# Altium schematic sheet Sheet1.SchDoc
size A4
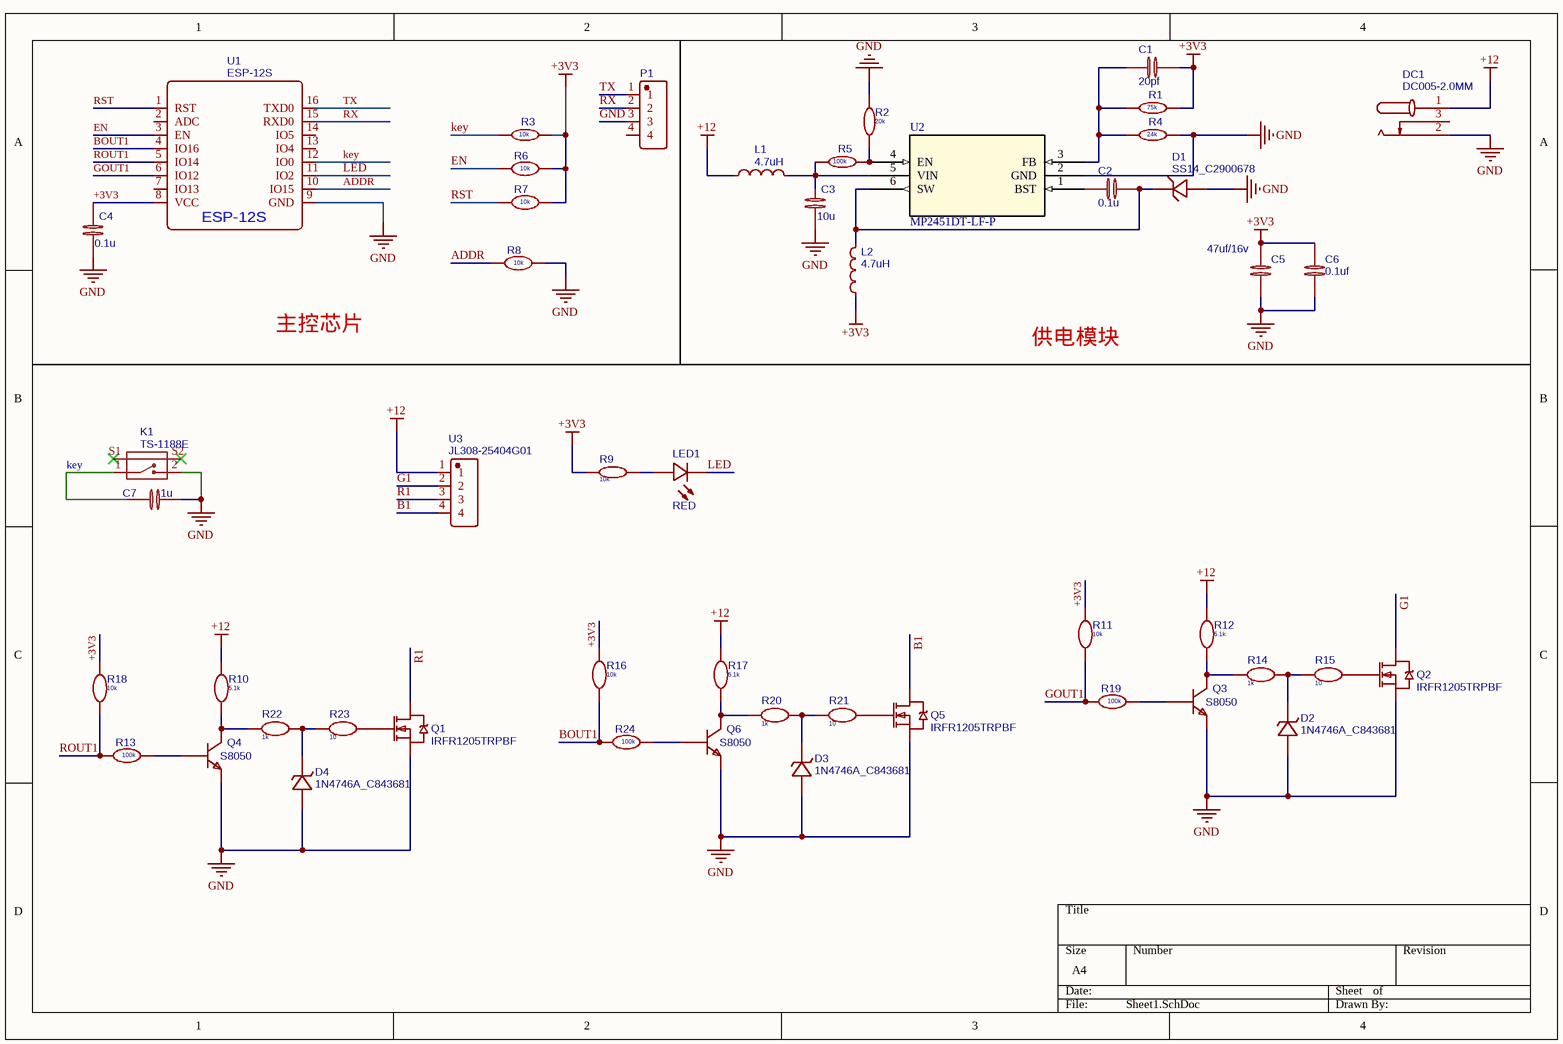
[diagram p0: Sheet1.SchDoc]

## Parts
C1  20pf  [C0603]
C2  0.1u  [C0603]
C3  10u  [C0603]
C4  0.1u  [C0603]
C5  47uf/16v  [C0603]
C6  0.1uf  [C0603]
C7  1u  [C0603]
D1  SS14_C2900678  [SMA_L4.3-W2.5-LS5.0-RD-1]
D2  1N4746A_C843681  [DO-41_BD2.8-L4.2-P8.00-D0.7-FD]
D3  1N4746A_C843681  [DO-41_BD2.8-L4.2-P8.00-D0.7-FD]
D4  1N4746A_C843681  [DO-41_BD2.8-L4.2-P8.00-D0.7-FD]
DC1  DC005-2.0MM  [DC-IN-TH_DC005-T20]
K1  TS-1188E  [SMD SWITCH 7X3.6X2.7]
L1  4.7uH  [IND-SMD_L7.3-W6.6_MHCI06030]
L2  4.7uH  [IND-SMD_L7.3-W6.6_MHCI06030]
LED1  RED  [LED0603-R-RD]
P1  (no value)  [HDR-TH_4P-P2.54-V-M]
Q1  IRFR1205TRPBF  [TO-252-2_L6.5-W6.1-P4.58-LS10.0-TR]
Q2  IRFR1205TRPBF  [TO-252-2_L6.5-W6.1-P4.58-LS10.0-TR]
Q3  S8050  [SOT-23(SOT-23-3)]
Q4  S8050  [SOT-23(SOT-23-3)]
Q5  IRFR1205TRPBF  [TO-252-2_L6.5-W6.1-P4.58-LS10.0-TR]
Q6  S8050  [SOT-23(SOT-23-3)]
R1  75k  [R0603]
R2  20k  [R0603]
R3  10k  [R0603]
R4  24k  [R0603]
R5  100k  [R0603]
R6  10k  [R0603]
R7  10k  [R0603]
R8  10k  [R0603]
R9  10k  [R0603]
R10  5.1k  [R0603]
R11  10k  [R0603]
R12  5.1k  [R0603]
R13  100k  [R0603]
R14  1k  [R0603]
R15  10  [R0603]
R16  10k  [R0603]
R17  5.1k  [R0603]
R18  10k  [R0603]
R19  100k  [R0603]
R20  1k  [R0603]
R21  10  [R0603]
R22  1k  [R0603]
R23  10  [R0603]
R24  100k  [R0603]
U1  ESP-12S  [WIFIM-SMD_ESP-12F-ESP8266MOD]
U2  MP2451DT-LF-P  [SOT23-6_MPS]
U3  JL308-25404G01  [CONN-TH_4P-P2.54_JILN_JL308-25404G01]

## Nets
+3V3: C1.2 C4.2 C5.2 C6.2 L2.1 R1.1 R3.1 R6.2 R7.2 R9.1 R11.2 R16.2 R18.2 U1.8(VCC)
+12: DC1.1 L1.1 R10.2 R12.2 R17.2 U3.1
GND: C3.1 C4.1 C5.1 C6.1 C7.1 D1.2(A) D2.2(A) D3.2(A) D4.2(A) DC1.2 K1.2 P1.3 Q1.3(S) Q2.3(S) Q3.2(E) Q4.2(E) Q5.3(S) Q6.2(E) R2.1 R4.1 R8.2 U1.9(GND) U2.2(GND)
ADDR: R8.1 U1.10(IO15)
B1: Q5.4(D) U3.4
BOUT1: R16.1 R24.1 U1.4(IO16)
EN: R6.1 U1.3(EN)
G1: Q2.4(D) U3.2
GOUT1: R11.1 R19.1 U1.6(IO12)
key: C7.2 K1.1 R3.2 U1.12(IO0)
LED: LED1.2(-) U1.11(IO2)
R1: Q1.4(D) U3.3
ROUT1: R13.1 R18.1 U1.5(IO14)
RST: R7.1 U1.1(RST)
RX: P1.2 U1.15(RXD0)
TX: P1.1 U1.16(TXD0)
NetC1_1: C1.1 R1.2 R4.2 U2.3(FB)
NetC2_1: C2.1 U2.1(BST)
NetC2_2: C2.2 D1.1(C) L2.2 U2.6(SW)
NetC3_2: C3.2 L1.2 R5.2 U2.5(VIN)
NetD2_1: D2.1(K) R14.1 R15.2
NetD3_1: D3.1(K) R20.1 R21.2
NetD4_1: D4.1(K) R22.1 R23.2
NetLED1_1: LED1.1(+) R9.2
NetQ1_1: Q1.1(G) R23.1
NetQ2_1: Q2.1(G) R15.1
NetQ3_1: Q3.1(B) R19.2
NetQ3_3: Q3.3(C) R12.1 R14.2
NetQ4_1: Q4.1(B) R13.2
NetQ4_3: Q4.3(C) R10.1 R22.2
NetQ5_1: Q5.1(G) R21.1
NetQ6_1: Q6.1(B) R24.2
NetQ6_3: Q6.3(C) R17.1 R20.2
NetR2_2: R2.2 R5.1 U2.4(EN)

Not connected (* = marked no-connect by the designer): DC1 3; K1 S1* S2*; P1 4; U1 2(ADC) 7(IO13) 13(IO4) 14(IO5)

## Notes on the sheet
- 主控芯片
- 供电模块

## Library data of the parts
C1-C6 = 0.1u: nameAlias: Value(F); Contributor: LCEDA_Lib; spicePre: C; spiceSymbolName: C_0603_EU
C7 = 1u: nameAlias: Value(F); Contributor: LCEDA_Lib; spicePre: C; spiceSymbolName: C_0603_EU
D1 = SS14_C2900678: BOM_Manufacturer: BLUE ROCKET(蓝箭); BOM_Manufacturer Part: SS14; Contributor: LCSC; BOM_Supplier: LCSC; BOM_Supplier Part: C2900678; spicePre: D; spiceSymbolName: SS14_C2900678
D2-D4 = 1N4746A_C843681: BOM_Manufacturer: FUXINSEMI(富芯森美); Contributor: LCSC; BOM_Supplier: LCSC; BOM_Supplier Part: C843681; BOM_Manufacturer Part: 1N4746A; spicePre: D; spiceSymbolName: 1N4746A_C843681
DC1 = DC005-2.0MM: BOM_Manufacturer: SOFNG; BOM_Supplier: LCSC; BOM_Manufacturer Part: DC005-2.0MM; BOM_Supplier Part: C111567; BOM_JLCPCB Part Class: Extended Part; spicePre: D; spiceSymbolName: DC005-2.0MM
K1 = TS-1188E: BOM_Manufacturer: ReliaPro; BOM_Manufacturer Part: 3*6*3.5 Side press  High temperature; catid: 20; spicePre: K; BOM_Supplier: LCSC; BOM_Supplier Part: C37327
L1 L2 = 4.7uH: BOM_Manufacturer: SXN; BOM_Manufacturer Part: SMMS0630-4R7M; nameAlias: Inductance; BOM_Supplier: LCSC; BOM_Supplier Part: C128688; BOM_JLCPCB Part Class: Extended Part; spicePre: L; spiceSymbolName: SMMS0630-4R7M
LED1 = RED: BOM_Manufacturer: EKINGLUX; BOM_Manufacturer Part: E6C0603URAC1UDA; Contributor: LCSC; BOM_Supplier: LCSC; BOM_Supplier Part: C375444; spicePre: L; spiceSymbolName: E6C0603URAC1UDA
P1 = KH-2.54PH180-1X4P-L11.5: BOM_Manufacturer: kinghelm(金航标); Contributor: LCSC; BOM_Supplier: LCSC; BOM_Supplier Part: C2905435; BOM_Manufacturer Part: KH-2.54PH180-1X4P-L11.5; spicePre: H; spiceSymbolName: KH-2.54PH180-1X4P-L11.5
Q1 Q2 Q5 = IRFR1205TRPBF: BOM_Manufacturer: Infineon; BOM_Supplier: LCSC; BOM_Manufacturer Part: IRFR1205TRPBF; BOM_Supplier Part: C81467; BOM_JLCPCB Part Class: Extended Part; spicePre: Q; spiceSymbolName: IRFR1205TRPBF
Q3 Q4 Q6 = S8050: BOM_Manufacturer: Yenji; Contributor: LCSC; SMT Type: Extend; BOM_Supplier: LCSC; BOM_Manufacturer Part: S8050; BOM_Supplier Part: C139514; BOM_LCSC Assembly: Yes; spicePre: Q
R1-R5 R9 = 10k: BOM_Manufacturer Part: CRCW060310K0JNEA; BOM_Manufacturer: Vishay Intertech; nameAlias: Value(Ω); spicePre: R; spiceSymbolName: Resistor; BOM_Supplier: LCSC; BOM_Supplier Part: C169103
R6-R8 R10-R24 = NC: nameAlias: Value(Ω); Contributor: LCEDA_Lib; spicePre: R; spiceSymbolName: R_0603_EU
U1 = ESP-12S: BOM_Manufacturer: Ai-Thinker; Contributor: HalfSweet; SMT Type: Extend; BOM_Supplier: LCSC; BOM_Manufacturer Part: ESP-12S; BOM_Supplier Part: C82898; BOM_JLCPCB SMD: Yes; spicePre: U; spiceSymbolName: ESP-12S
U2 = MP2451DT-LF-P: No Description Available; Mfr_Name: Monolithic Power Systems; Copyright: Copyright (C) 2022 Ultra Librarian. All rights reserved.; Manufacturer_Part_Number: MP2451DT-LF-P; RefDes: RefDes; Type: DEV
U3 = JL308-25404G01: BOM_Manufacturer: JILN(锦凌); Contributor: LCSC; BOM_Supplier: LCSC; BOM_Supplier Part: C2922599; BOM_Manufacturer Part: JL308-25404G01; spicePre: U; spiceSymbolName: JL308-25404G01